# Altium project PlacaTP1_ASSD.PrjPcb
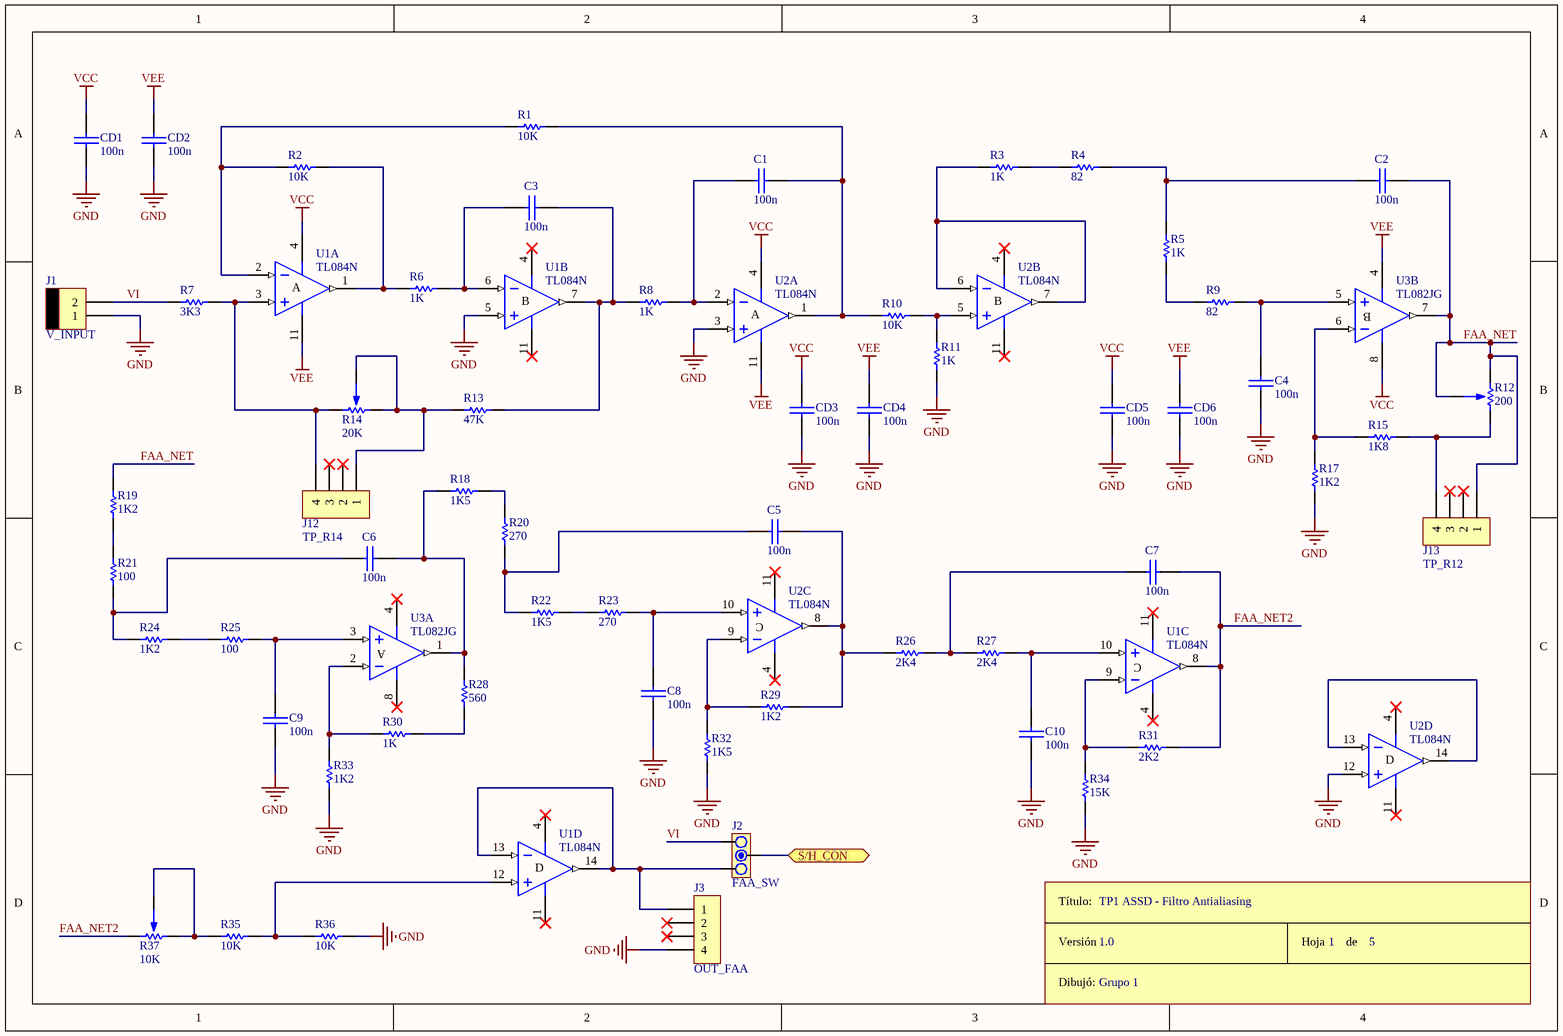
[diagram p0: FiltroAntialiasing.SchDoc]
5 sheets, 171 parts. Net scope: flat (ports and power ports of the same name join across sheets).
Board file: Placa_TP1.PcbDoc
Sheets:
  FiltroAntialiasing.SchDoc
  SampleANDHold.SchDoc
  LLaveAnalogica.SchDoc
  FiltroRecuperador.SchDoc
  Oscilador.SchDoc

## Sheet FiltroAntialiasing.SchDoc
size A4

### Parts
C1  100n  [CAP100]
C2  100n  [CAP100]
C3  100n  [CAP100]
C4  100n  [CAP100]
C5  100n  [CAP100]
C6  100n  [CAP100]
C7  100n  [CAP100]
C8  100n  [CAP100]
C9  100n  [CAP100]
C10  100n  [CAP100]
CD1  100n  [CAP100]
CD2  100n  [CAP100]
CD3  100n  [CAP100]
CD4  100n  [CAP100]
CD5  100n  [CAP100]
CD6  100n  [CAP100]
J1  V_INPUT  [MOLEX2]
J2  FAA_SW  [JUMPER3]
J3  OUT_FAA  [SIP4]
J12  TP_R14  [SIP4]
J13  TP_R12  [SIP4]
R1  10K  [RES400]
R2  10K  [RES400]
R3  1K  [RES400]
R4  82  [RES400]
R5  1K  [RES400]
R6  1K  [RES400]
R7  3K3  [RES400]
R8  1K  [RES400]
R9  82  [RES400]
R10  10K  [RES400]
R11  1K  [RES400]
R12  200  [PRESET V]
R13  47K  [RES400]
R14  20K  [PRESET V]
R15  1K8  [RES400]
R17  1K2  [RES400]
R18  1K5  [RES400]
R19  1K2  [RES400]
R20  270  [RES400]
R21  100  [RES400]
R22  1K5  [RES400]
R23  270  [RES400]
R24  1K2  [RES400]
R25  100  [RES400]
R26  2K4  [RES400]
R27  2K4  [RES400]
R28  560  [RES400]
R29  1K2  [RES400]
R30  1K  [RES400]
R31  2K2  [RES400]
R32  1K5  [RES400]
R33  1K2  [RES400]
R34  15K  [RES400]
R35  10K  [RES400]
R36  10K  [RES400]
R37  10K  [PRESET V]
ROT1  Rótulo  (value not drawn)
U1  TL084N  [N014]  (parts A,B,C,D of 4)
U2  TL084N  [N014]  (parts A,B,C,D of 4)
U3  TL082JG  [JG008]  (parts A,B of 2)

### Ports
S/H_CON

### Nets
GND: C4.2 C8.2 C9.1 C10.2 CD1.2 CD2.1 CD2.2 CD3.2 CD4.1 CD4.2 CD5.2 CD6.1 CD6.2 J1.1 J3.4 R11.1 R17.1 R32.1 R33.1 R34.1 R36.1 U1.5(IN+) U1.11(V-) U2.3(IN+) U2.11(V-) U2.12(IN+) U3.4(V-)  [also labelled VEE]
VCC: CD1.1 CD3.1 CD5.1 U1.4(V+) U2.4(V+) U3.8(V+)
FAA_NET: C2.2 J13.1 R12.2 R12.3 R19.1 U3.7(OUT)
FAA_NET2: C7.2 R31.2 R37.1 U1.8(OUT)
VI: J1.2 J2.3 R7.1
NetC1_1: C1.1 R8.2 U2.2(IN-)
NetC1_2: C1.2 R1.2 R10.1 U2.1(OUT)
NetC2_1: C2.1 R4.2 R5.2
NetC3_1: C3.1 R6.2 U1.6(IN-)
NetC3_2: C3.2 R8.1 R13.2 U1.7(OUT)
NetC4_1: C4.1 R9.2 U3.5(IN+)
NetC5_1: C5.1 R20.2 R22.1
NetC5_2: C5.2 R26.1 R29.2 U2.8(OUT)
NetC6_1: C6.1 R21.2 R24.1
NetC6_2: C6.2 R18.2 R28.2 U3.1(OUT)
NetC7_1: C7.1 R26.2 R27.1
NetC8_1: C8.1 R23.2 U2.10(IN+)
NetC9_2: C9.2 R25.2 U3.3(IN+)
NetC10_1: C10.1 R27.2 U1.10(IN+)
NetJ2_1: J2.1 J3.1 U1.13(IN-) U1.14(OUT)
NetJ2_2: J2.2 ; port S/H_CON
NetJ12_1: J12.1 R13.1 R14.2 R14.3
NetJ12_4: J12.4 R7.2 R14.1 U1.3(IN+)
NetJ13_4: J13.4 R12.1 R15.2
NetR1_1: R1.1 R2.1 U1.2(IN-)
NetR2_2: R2.2 R6.1 U1.1(OUT)
NetR3_1: R3.1 R4.1
NetR3_2: R3.2 U2.6(IN-) U2.7(OUT)
NetR5_1: R5.1 R9.1
NetR10_2: R10.2 R11.2 U2.5(IN+)
NetR15_1: R15.1 R17.2 U3.6(IN-)
NetR18_1: R18.1 R20.1
NetR19_2: R19.2 R21.1
NetR22_2: R22.2 R23.1
NetR24_2: R24.2 R25.1
NetR28_1: R28.1 R30.2
NetR29_1: R29.1 R32.2 U2.9(IN-)
NetR30_1: R30.1 R33.2 U3.2(IN-)
NetR31_1: R31.1 R34.2 U1.9(IN-)
NetR35_1: R35.1 R37.2 R37.3
NetR35_2: R35.2 R36.2 U1.12(IN+)
NetU2_13: U2.13(IN-) U2.14(OUT)

Not connected (* = marked no-connect by the designer): J3 2* 3*; J12 2* 3*; J13 2* 3*

### Notes on the sheet
- TP1 ASSD - Filtro Antialiasing
- 1.0
- Grupo 1
- 1
- 5
- (in symbol Rótulo) Título:; Versión; Hoja       de; Dibujó:
- (in symbol TL082JG, part A) A
- (in symbol TL082JG, part B) B
- (in symbol TL084N, part A) A
- (in symbol TL084N, part B) B
- (in symbol TL084N, part C) C
- (in symbol TL084N, part D) D

### Library data of the parts
C1-C10 CD1-CD6 = CAP
J1 = MOLEX2
J2 = JUMPER3
J3 J12 J13 = CON4
R1-R11 R13 R15 R17-R36 = RES
R12 R14 R37 = PRESET
U1 U2 = TL084N: JFET-Input Operational Amplifier; Published: 16-Jan-2001; LatestRevisionDate: 04-Mar-2005; LatestRevisionNote: Stylized 3D Model Added.; DatasheetVersion: Feb-1999; PackageVersion: Oct-1995; PackageReference: N014; Publisher: Altium Limited; PackageDescription: DIP; 14 Leads; Row Spacing 7.62 mm; Pitch 2.54 mm; ComponentLink1Description: Manufacturer Link; ComponentLink1URL: http://www.ti.com/; ComponentLink2Description: Datasheet; ComponentLink2URL: http://www-s.ti.com/sc/ds/tl084.pdf
U3 = TL082JG: JFET-Input Operational Amplifier; Published: 16-Jan-2001; LatestRevisionDate: 04-Mar-2005; LatestRevisionNote: Stylized 3D Model Added.; DatasheetVersion: Feb-1999; PackageVersion: Jan-1995; PackageReference: JG008; Publisher: Altium Limited; PackageDescription: DIP; 8 Leads; Row Spacing 7.62 mm; Pitch 2.54 mm; ComponentLink1Description: Manufacturer Link; ComponentLink1URL: http://www.ti.com/; ComponentLink2Description: Datasheet; ComponentLink2URL: http://www-s.ti.com/sc/ds/tl082.pdf

## Sheet SampleANDHold.SchDoc
size A4
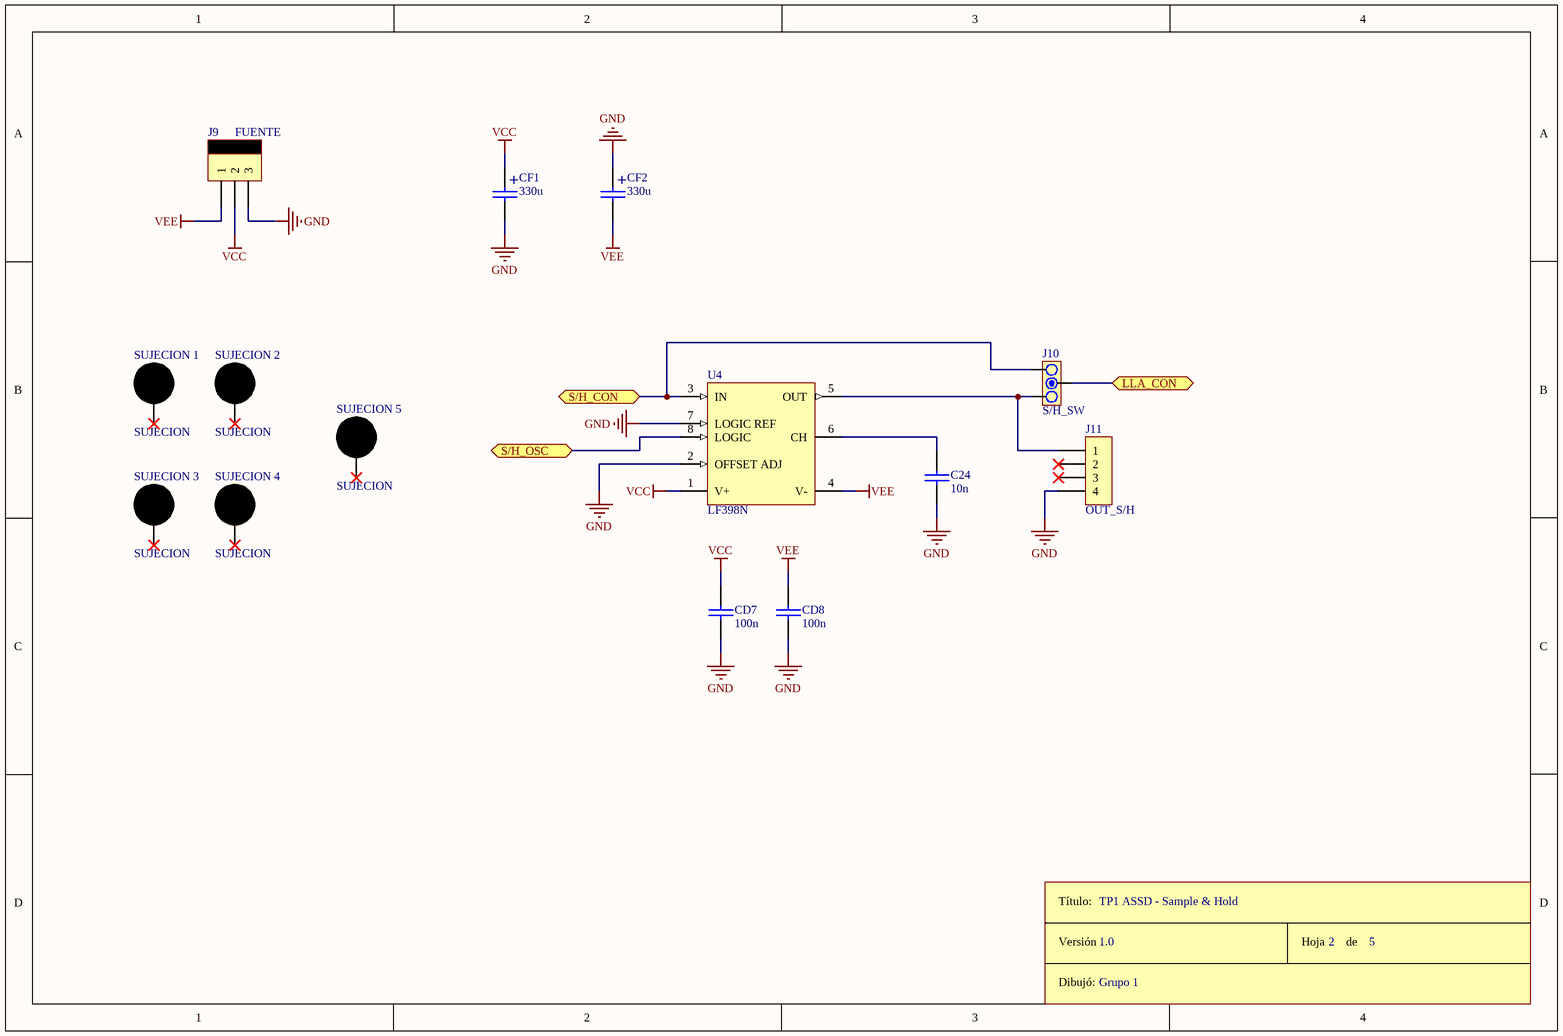
[diagram p1: SampleANDHold.SchDoc]

### Parts
C24  10n  [CAP100]
CD7  100n  [CAP100]
CD8  100n  [CAP100]
CF1  330u  [CAP200RP]
CF2  330u  [CAP200RP]
J9  FUENTE  [MOLEX3]
J10  S/H_SW  [JUMPER3]
J11  OUT_S/H  [SIP4]
ROT2  Rótulo  (value not drawn)
SUJECION_1  SUJECION  [SUJECION (5.00MM - 3.50MM)]
SUJECION_2  SUJECION  [SUJECION (5.00MM - 3.50MM)]
SUJECION_3  SUJECION  [SUJECION (5.00MM - 3.50MM)]
SUJECION_4  SUJECION  [SUJECION (5.00MM - 3.50MM)]
SUJECION_5  SUJECION  [SUJECION (5.00MM - 3.50MM)]
U4  LF398N  [N08E]

### Ports
LLA_CON, S/H_CON, S/H_OSC

### Nets
GND: C24.2 CD7.2 CD8.1 CD8.2 CF1.2 CF2.1 CF2.2 J9.1 J9.3 J11.4 U4.2(OFFSET_ADJ) U4.4(V-) U4.7(LOGIC_REF)  [also labelled VEE]
VCC: CD7.1 CF1.1 J9.2 U4.1(V+)
NetC24_1: C24.1 U4.6(CH)
NetJ2_2: J10.3 U4.3(IN) ; port S/H_CON
NetJ6_3: J10.2 ; port LLA_CON
NetJ10_1: J10.1 J11.1 U4.5(OUT)
NetJ16_1: U4.8(LOGIC) ; port S/H_OSC

Not connected (* = marked no-connect by the designer): J11 2* 3*; SUJECION_1 1*; SUJECION_2 1*; SUJECION_3 1*; SUJECION_4 1*; SUJECION_5 1*

### Notes on the sheet
- TP1 ASSD - Sample & Hold
- 1.0
- Grupo 1
- 2
- 5
- (in symbol CAPPOL) +
- (in symbol Rótulo) Título:; Versión; Hoja       de; Dibujó:

### Library data of the parts
C24 CD7 CD8 = CAP
CF1 CF2 = CAPPOL
J9 = MOLEX3
J10 = JUMPER3
J11 = CON4
U4 = LF398N: Monolithic Sample-and-Hold Circuits; Manufacturer: National Semiconductor; CompType: Analog IC; PackageTopMarking: NSUZXYTT*LF*398N; PowerWise: N; Published: 4-Dec-2008; DatasheetVersion: Jul-2000; PackageVersion: revG, May-2006; PackageReference: N08E; Publisher: Altium Limited; PackageDescription: MDIP, .365 x .250 x .130in, 8 Lead, .100in Pitch; PartNumber: LF398N; PinCount: 8; DigiKeyPartNumber: LF398N-ND; Code_JEDEC: MS-001-BA; ComponentLink1Description: LF398 Datasheet; ComponentLink1URL: http://www.national.com/ds.cgi/LF/LF398.pdf; ComponentLink2Description: LF398 Web Page; ComponentLink2URL: http://www.national.com/pf/LF/LF398.html; ComponentLink3Description: N08E package page; ComponentLink3URL: http://www.national.com/packaging/folders/n08e.html

## Sheet LLaveAnalogica.SchDoc
size A4
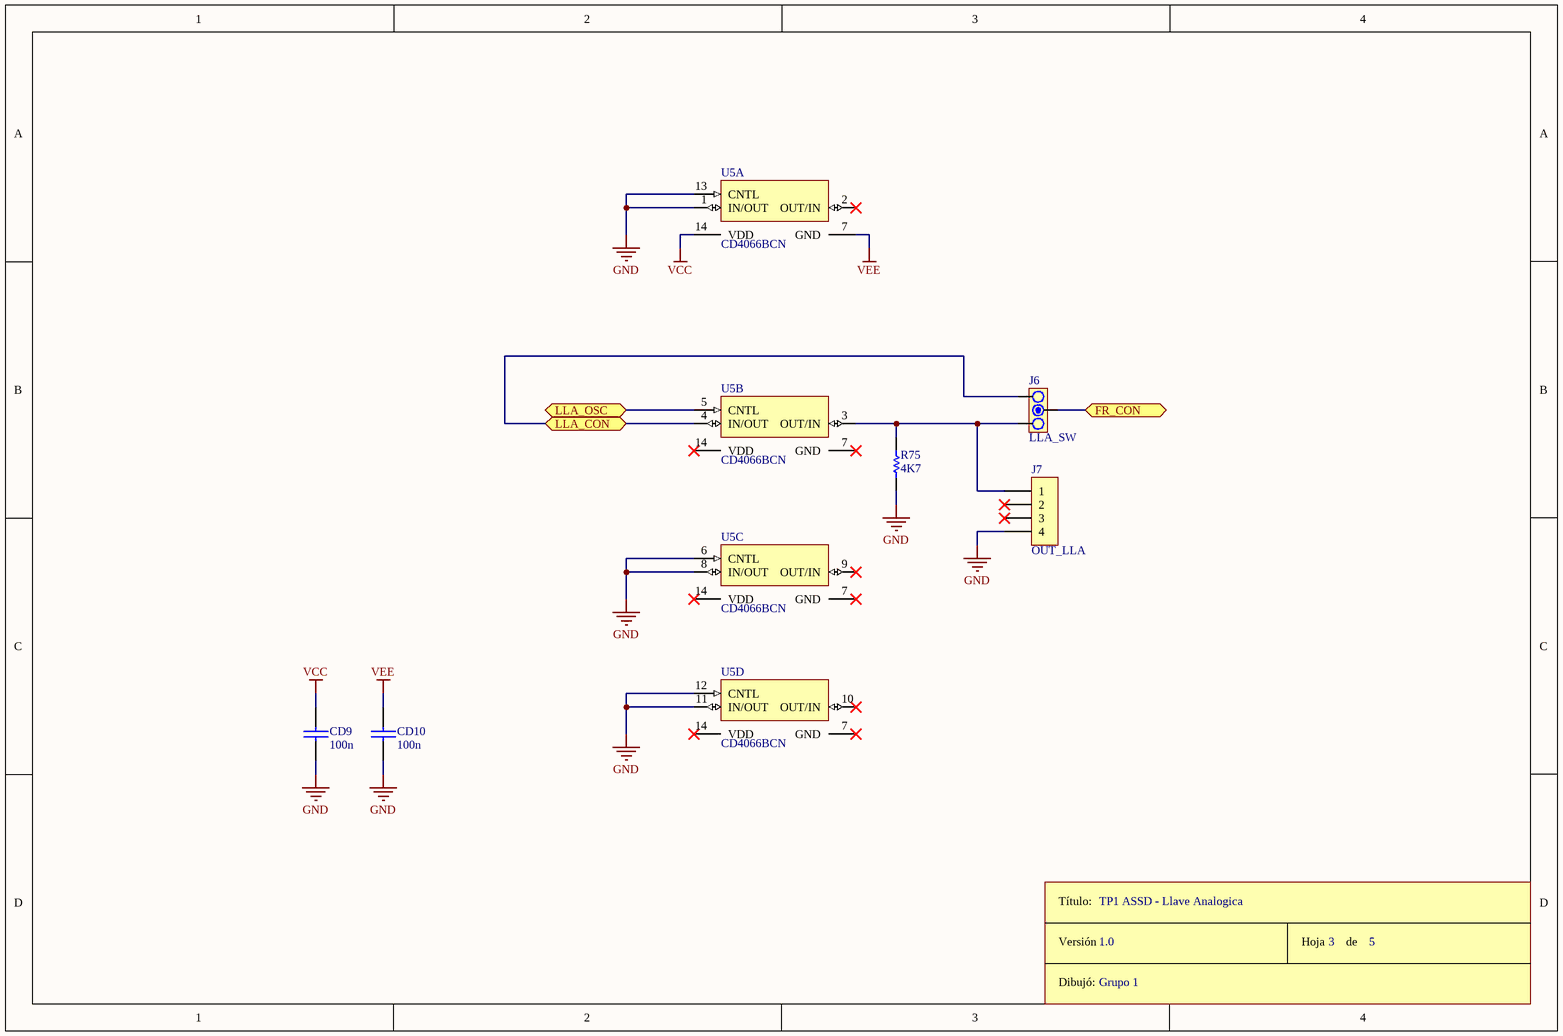
[diagram p2: LLaveAnalogica.SchDoc]

### Parts
CD9  100n  [CAP100]
CD10  100n  [CAP100]
J6  LLA_SW  [JUMPER3]
J7  OUT_LLA  [SIP4]
R75  4K7  [RES400]
ROT3  Rótulo  (value not drawn)
U5  CD4066BCN  [N14A]  (parts A,B,C,D of 4)

### Ports
FR_CON, LLA_CON, LLA_OSC

### Nets
GND: CD9.2 CD10.1 CD10.2 J7.4 R75.1 U5.1(IN/OUT) U5.6(CNTL) U5.7(GND) U5.8(IN/OUT) U5.11(IN/OUT) U5.12(CNTL) U5.13(CNTL)  [also labelled VEE]
VCC: CD9.1 U5.14(VDD)  [also labelled VDD]
NetJ4_3: J6.2 ; port FR_CON
NetJ6_1: J6.1 J7.1 R75.2 U5.3(OUT/IN)
NetJ6_3: J6.3 U5.4(IN/OUT) ; port LLA_CON
NetJ17_1: U5.5(CNTL) ; port LLA_OSC

Not connected (* = marked no-connect by the designer): J7 2* 3*; U5 2(OUT/IN)* 9(OUT/IN)* 10(OUT/IN)*

### Notes on the sheet
- TP1 ASSD - Llave Analogica
- 1.0
- Grupo 1
- 3
- 5
- (in symbol Rótulo) Título:; Versión; Hoja       de; Dibujó:

### Library data of the parts
CD9 CD10 = CAP
J6 = JUMPER3
J7 = CON4
R75 = RES
U5 = CD4066BCN: Quad Bilateral Switch; Published: 17-Jul-2002; LatestRevisionDate: 29-May-2009; LatestRevisionNote: Component Body Added.; DatasheetVersion: Dec-1998; PackageVersion: 2000; PackageReference: N14A; Publisher: Altium Limited; PackageDescription: DIP, 14-Pin, Row Spacing 7.62 mm, Pitch 2.54 mm; ComponentLink1Description: Manufacturer Link; ComponentLink1URL: http://www.fairchildsemi.com/; ComponentLink2Description: Datasheet; ComponentLink2URL: http://www.fairchildsemi.com/ds/CD%2FCD4069UBC.pdf

## Sheet FiltroRecuperador.SchDoc
size A4
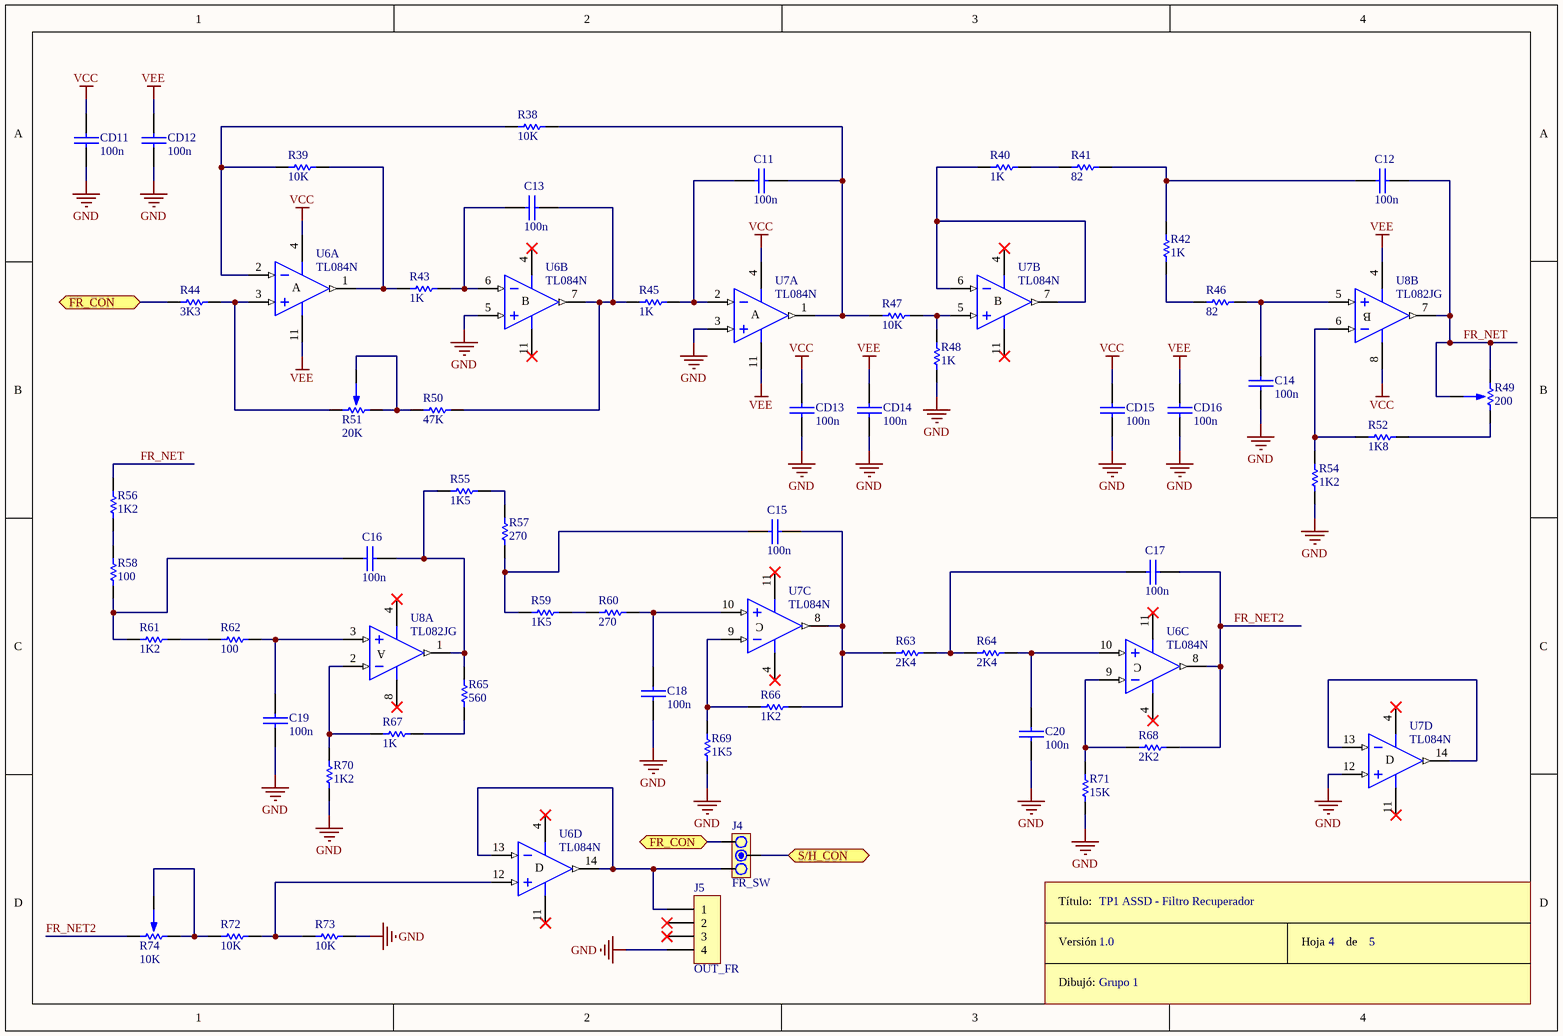
[diagram p3: FiltroRecuperador.SchDoc]

### Parts
C11  100n  [CAP100]
C12  100n  [CAP100]
C13  100n  [CAP100]
C14  100n  [CAP100]
C15  100n  [CAP100]
C16  100n  [CAP100]
C17  100n  [CAP100]
C18  100n  [CAP100]
C19  100n  [CAP100]
C20  100n  [CAP100]
CD11  100n  [CAP100]
CD12  100n  [CAP100]
CD13  100n  [CAP100]
CD14  100n  [CAP100]
CD15  100n  [CAP100]
CD16  100n  [CAP100]
J4  FR_SW  [JUMPER3]
J5  OUT_FR  [SIP4]
R38  10K  [RES400]
R39  10K  [RES400]
R40  1K  [RES400]
R41  82  [RES400]
R42  1K  [RES400]
R43  1K  [RES400]
R44  3K3  [RES400]
R45  1K  [RES400]
R46  82  [RES400]
R47  10K  [RES400]
R48  1K  [RES400]
R49  200  [PRESET V]
R50  47K  [RES400]
R51  20K  [PRESET V]
R52  1K8  [RES400]
R54  1K2  [RES400]
R55  1K5  [RES400]
R56  1K2  [RES400]
R57  270  [RES400]
R58  100  [RES400]
R59  1K5  [RES400]
R60  270  [RES400]
R61  1K2  [RES400]
R62  100  [RES400]
R63  2K4  [RES400]
R64  2K4  [RES400]
R65  560  [RES400]
R66  1K2  [RES400]
R67  1K  [RES400]
R68  2K2  [RES400]
R69  1K5  [RES400]
R70  1K2  [RES400]
R71  15K  [RES400]
R72  10K  [RES400]
R73  10K  [RES400]
R74  10K  [PRESET V]
ROT4  Rótulo  (value not drawn)
U6  TL084N  [N014]  (parts A,B,C,D of 4)
U7  TL084N  [N014]  (parts A,B,C,D of 4)
U8  TL082JG  [JG008]  (parts A,B of 2)

### Ports
FR_CON, S/H_CON

### Nets
GND: C14.2 C18.2 C19.1 C20.2 CD11.2 CD12.1 CD12.2 CD13.2 CD14.1 CD14.2 CD15.2 CD16.1 CD16.2 J5.4 R48.1 R54.1 R69.1 R70.1 R71.1 R73.1 U6.5(IN+) U6.11(V-) U7.3(IN+) U7.11(V-) U7.12(IN+) U8.4(V-)  [also labelled VEE]
VCC: CD11.1 CD13.1 CD15.1 U6.4(V+) U7.4(V+) U8.8(V+)
FR_NET: C12.2 R49.2 R49.3 R56.1 U8.7(OUT)
FR_NET2: C17.2 R68.2 R74.1 U6.8(OUT)
NetC11_1: C11.1 R45.2 U7.2(IN-)
NetC11_2: C11.2 R38.2 R47.1 U7.1(OUT)
NetC12_1: C12.1 R41.2 R42.2
NetC13_1: C13.1 R43.2 U6.6(IN-)
NetC13_2: C13.2 R45.1 R50.2 U6.7(OUT)
NetC14_1: C14.1 R46.2 U8.5(IN+)
NetC15_1: C15.1 R57.2 R59.1
NetC15_2: C15.2 R63.1 R66.2 U7.8(OUT)
NetC16_1: C16.1 R58.2 R61.1
NetC16_2: C16.2 R55.2 R65.2 U8.1(OUT)
NetC17_1: C17.1 R63.2 R64.1
NetC18_1: C18.1 R60.2 U7.10(IN+)
NetC19_2: C19.2 R62.2 U8.3(IN+)
NetC20_1: C20.1 R64.2 U6.10(IN+)
NetJ2_2: J4.2 ; port S/H_CON
NetJ4_1: J4.1 J5.1 U6.13(IN-) U6.14(OUT)
NetJ4_3: J4.3 R44.1 ; port FR_CON
NetR38_1: R38.1 R39.1 U6.2(IN-)
NetR39_2: R39.2 R43.1 U6.1(OUT)
NetR40_1: R40.1 R41.1
NetR40_2: R40.2 U7.6(IN-) U7.7(OUT)
NetR42_1: R42.1 R46.1
NetR44_2: R44.2 R51.1 U6.3(IN+)
NetR47_2: R47.2 R48.2 U7.5(IN+)
NetR49_1: R49.1 R52.2
NetR50_1: R50.1 R51.2 R51.3
NetR52_1: R52.1 R54.2 U8.6(IN-)
NetR55_1: R55.1 R57.1
NetR56_2: R56.2 R58.1
NetR59_2: R59.2 R60.1
NetR61_2: R61.2 R62.1
NetR65_1: R65.1 R67.2
NetR66_1: R66.1 R69.2 U7.9(IN-)
NetR67_1: R67.1 R70.2 U8.2(IN-)
NetR68_1: R68.1 R71.2 U6.9(IN-)
NetR72_1: R72.1 R74.2 R74.3
NetR72_2: R72.2 R73.2 U6.12(IN+)
NetU7_13: U7.13(IN-) U7.14(OUT)

Not connected (* = marked no-connect by the designer): J5 2* 3*

### Notes on the sheet
- TP1 ASSD - Filtro Recuperador
- 1.0
- Grupo 1
- 4
- 5
- (in symbol Rótulo) Título:; Versión; Hoja       de; Dibujó:
- (in symbol TL082JG, part A) A
- (in symbol TL082JG, part B) B
- (in symbol TL084N, part A) A
- (in symbol TL084N, part B) B
- (in symbol TL084N, part C) C
- (in symbol TL084N, part D) D

### Library data of the parts
C11-C20 CD11-CD16 = CAP
J4 = JUMPER3
J5 = CON4
R38-R48 R50 R52 R54-R73 = RES
R49 R51 R74 = PRESET
U6 U7 = TL084N: JFET-Input Operational Amplifier; Published: 16-Jan-2001; LatestRevisionDate: 04-Mar-2005; LatestRevisionNote: Stylized 3D Model Added.; DatasheetVersion: Feb-1999; PackageVersion: Oct-1995; PackageReference: N014; Publisher: Altium Limited; PackageDescription: DIP; 14 Leads; Row Spacing 7.62 mm; Pitch 2.54 mm; ComponentLink1Description: Manufacturer Link; ComponentLink1URL: http://www.ti.com/; ComponentLink2Description: Datasheet; ComponentLink2URL: http://www-s.ti.com/sc/ds/tl084.pdf
U8 = TL082JG: JFET-Input Operational Amplifier; Published: 16-Jan-2001; LatestRevisionDate: 04-Mar-2005; LatestRevisionNote: Stylized 3D Model Added.; DatasheetVersion: Feb-1999; PackageVersion: Jan-1995; PackageReference: JG008; Publisher: Altium Limited; PackageDescription: DIP; 8 Leads; Row Spacing 7.62 mm; Pitch 2.54 mm; ComponentLink1Description: Manufacturer Link; ComponentLink1URL: http://www.ti.com/; ComponentLink2Description: Datasheet; ComponentLink2URL: http://www-s.ti.com/sc/ds/tl082.pdf

## Sheet Oscilador.SchDoc
size A4
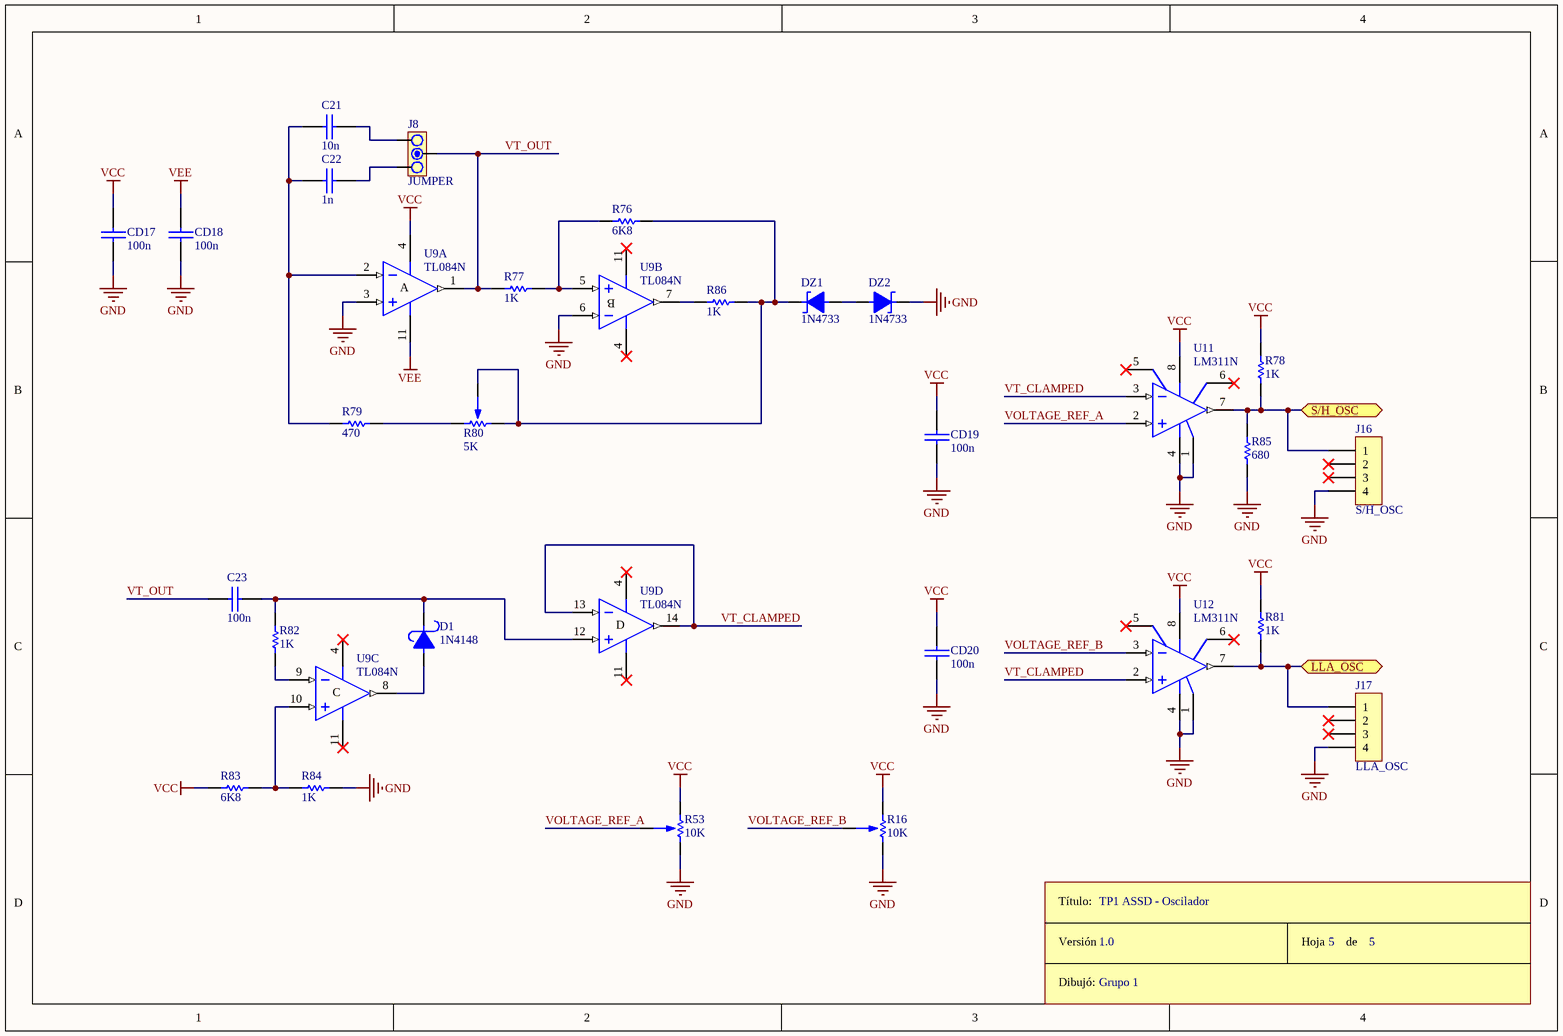
[diagram p4: Oscilador.SchDoc]

### Parts
C21  10n  [CAP100]
C22  1n  [CAP100]
C23  100n  [CAP100]
CD17  100n  [CAP100]
CD18  100n  [CAP100]
CD19  100n  [CAP100]
CD20  100n  [CAP100]
D1  1N4148  [DO41]
DZ1  1N4733  [DO41]
DZ2  1N4733  [DO41]
J8  JUMPER  [JUMPER3]
J16  S/H_OSC  [SIP4]
J17  LLA_OSC  [SIP4]
R16  10K  [PRESET V]
R53  10K  [PRESET V]
R76  6K8  [RES400]
R77  1K  [RES400]
R78  1K  [RES400]
R79  470  [RES400]
R80  5K  [PRESET V]
R81  1K  [RES400]
R82  1K  [RES400]
R83  6K8  [RES400]
R84  1K  [RES400]
R85  680  [RES400]
R86  1K  [RES400]
ROT5  Rótulo  (value not drawn)
U9  TL084N  [N014]  (parts A,B,C,D of 4)
U11  LM311N  [626-05]
U12  LM311N  [626-05]

### Ports
LLA_OSC, S/H_OSC

### Nets
GND: CD17.2 CD18.1 CD18.2 CD19.2 CD20.2 DZ2.2 J16.4 J17.4 R16.1 R53.1 R84.2 R85.1 U9.3(IN+) U9.6(IN-) U9.11(V-) U11.1(GND) U11.4(V-) U12.1(GND) U12.4(V-)  [also labelled VEE]
VCC: CD17.1 CD19.1 CD20.1 R16.3 R53.3 R78.2 R81.2 R83.1 U9.4(V+) U11.8(V+) U12.8(V+)
VOLTAGE_REF_A: R53.2 U11.2(IN+)
VOLTAGE_REF_B: R16.2 U12.3(IN-)
VT_CLAMPED: U9.13(IN-) U9.14(OUT) U11.3(IN-) U12.2(IN+)
VT_OUT: C23.1 J8.2 R77.1 U9.1(OUT)
NetC21_1: C21.1 C22.1 R79.1 U9.2(IN-)
NetC21_2: C21.2 J8.3
NetC22_2: C22.2 J8.1
NetC23_2: C23.2 D1.2 R82.2 U9.12(IN+)
NetD1_1: D1.1 U9.8(OUT)
NetDZ1_1: DZ1.1 DZ2.1
NetDZ1_2: DZ1.2 R76.2 R80.2 R80.3 R86.1
NetJ16_1: J16.1 R78.1 R85.2 U11.7(OUT) ; port S/H_OSC
NetJ17_1: J17.1 R81.1 U12.7(OUT) ; port LLA_OSC
NetR76_1: R76.1 R77.2 U9.5(IN+)
NetR79_2: R79.2 R80.1
NetR82_1: R82.1 U9.9(IN-)
NetR83_2: R83.2 R84.1 U9.10(IN+)
NetR86_2: R86.2 U9.7(OUT)

Not connected (* = marked no-connect by the designer): J16 2* 3*; J17 2* 3*; U11 5(BAL)* 6(BAL/STB)*; U12 5(BAL)* 6(BAL/STB)*

### Notes on the sheet
- TP1 ASSD - Oscilador
- 1.0
- Grupo 1
- 5
- (in symbol Rótulo) Título:; Versión; Hoja       de; Dibujó:
- (in symbol TL084N, part A) A
- (in symbol TL084N, part B) B
- (in symbol TL084N, part C) C
- (in symbol TL084N, part D) D

### Library data of the parts
C21-C23 CD17-CD20 = CAP
D1 = DIODO SCHOTTKY
DZ1 DZ2 = DIODO ZENER
J8 = JUMPER3
J16 J17 = CON4
R16 R53 R80 = PRESET
R76-R79 R81-R86 = RES
U9 = TL084N: JFET-Input Operational Amplifier; Published: 16-Jan-2001; LatestRevisionDate: 04-Mar-2005; LatestRevisionNote: Stylized 3D Model Added.; DatasheetVersion: Feb-1999; PackageVersion: Oct-1995; PackageReference: N014; Publisher: Altium Limited; PackageDescription: DIP; 14 Leads; Row Spacing 7.62 mm; Pitch 2.54 mm; ComponentLink1Description: Manufacturer Link; ComponentLink1URL: http://www.ti.com/; ComponentLink2Description: Datasheet; ComponentLink2URL: http://www-s.ti.com/sc/ds/tl084.pdf
U11 U12 = LM311N: High-Performance Voltage Comparator; Published: 17-Jul-2002; LatestRevisionDate: 06-Jun-2005; LatestRevisionNote: Stylized 3D Model Added.; DatasheetVersion: 1988; PackageReference: 626-05; Publisher: Altium Limited; PackageDescription: DIP; 8 Leads; Row Spacing 7.62 mm; Pitch 2.54 mm; ComponentLink1Description: Manufacturer Link; ComponentLink1URL: http://www.onsemi.com/site/products/taxonomy/0,4438,133,00.html

## Nets that join several sheets
GND: FiltroAntialiasing (27 pins), SampleANDHold (13 pins), LLaveAnalogica (12 pins), FiltroRecuperador (26 pins), Oscilador (19 pins)
VCC: FiltroAntialiasing (6 pins), SampleANDHold (CD7.1 CF1.1 J9.2 U4.1), LLaveAnalogica (CD9.1 U5.14), FiltroRecuperador (6 pins), Oscilador (11 pins)
NetJ2_2: FiltroAntialiasing (J2.2), SampleANDHold (J10.3 U4.3), FiltroRecuperador (J4.2)
NetJ4_3: LLaveAnalogica (J6.2), FiltroRecuperador (J4.3 R44.1)
NetJ6_3: SampleANDHold (J10.2), LLaveAnalogica (J6.3 U5.4)
NetJ16_1: SampleANDHold (U4.8), Oscilador (J16.1 R78.1 R85.2 U11.7)
NetJ17_1: LLaveAnalogica (U5.5), Oscilador (J17.1 R81.1 U12.7)